# EAGLE design Hoff (EAGLE 7.2.0)
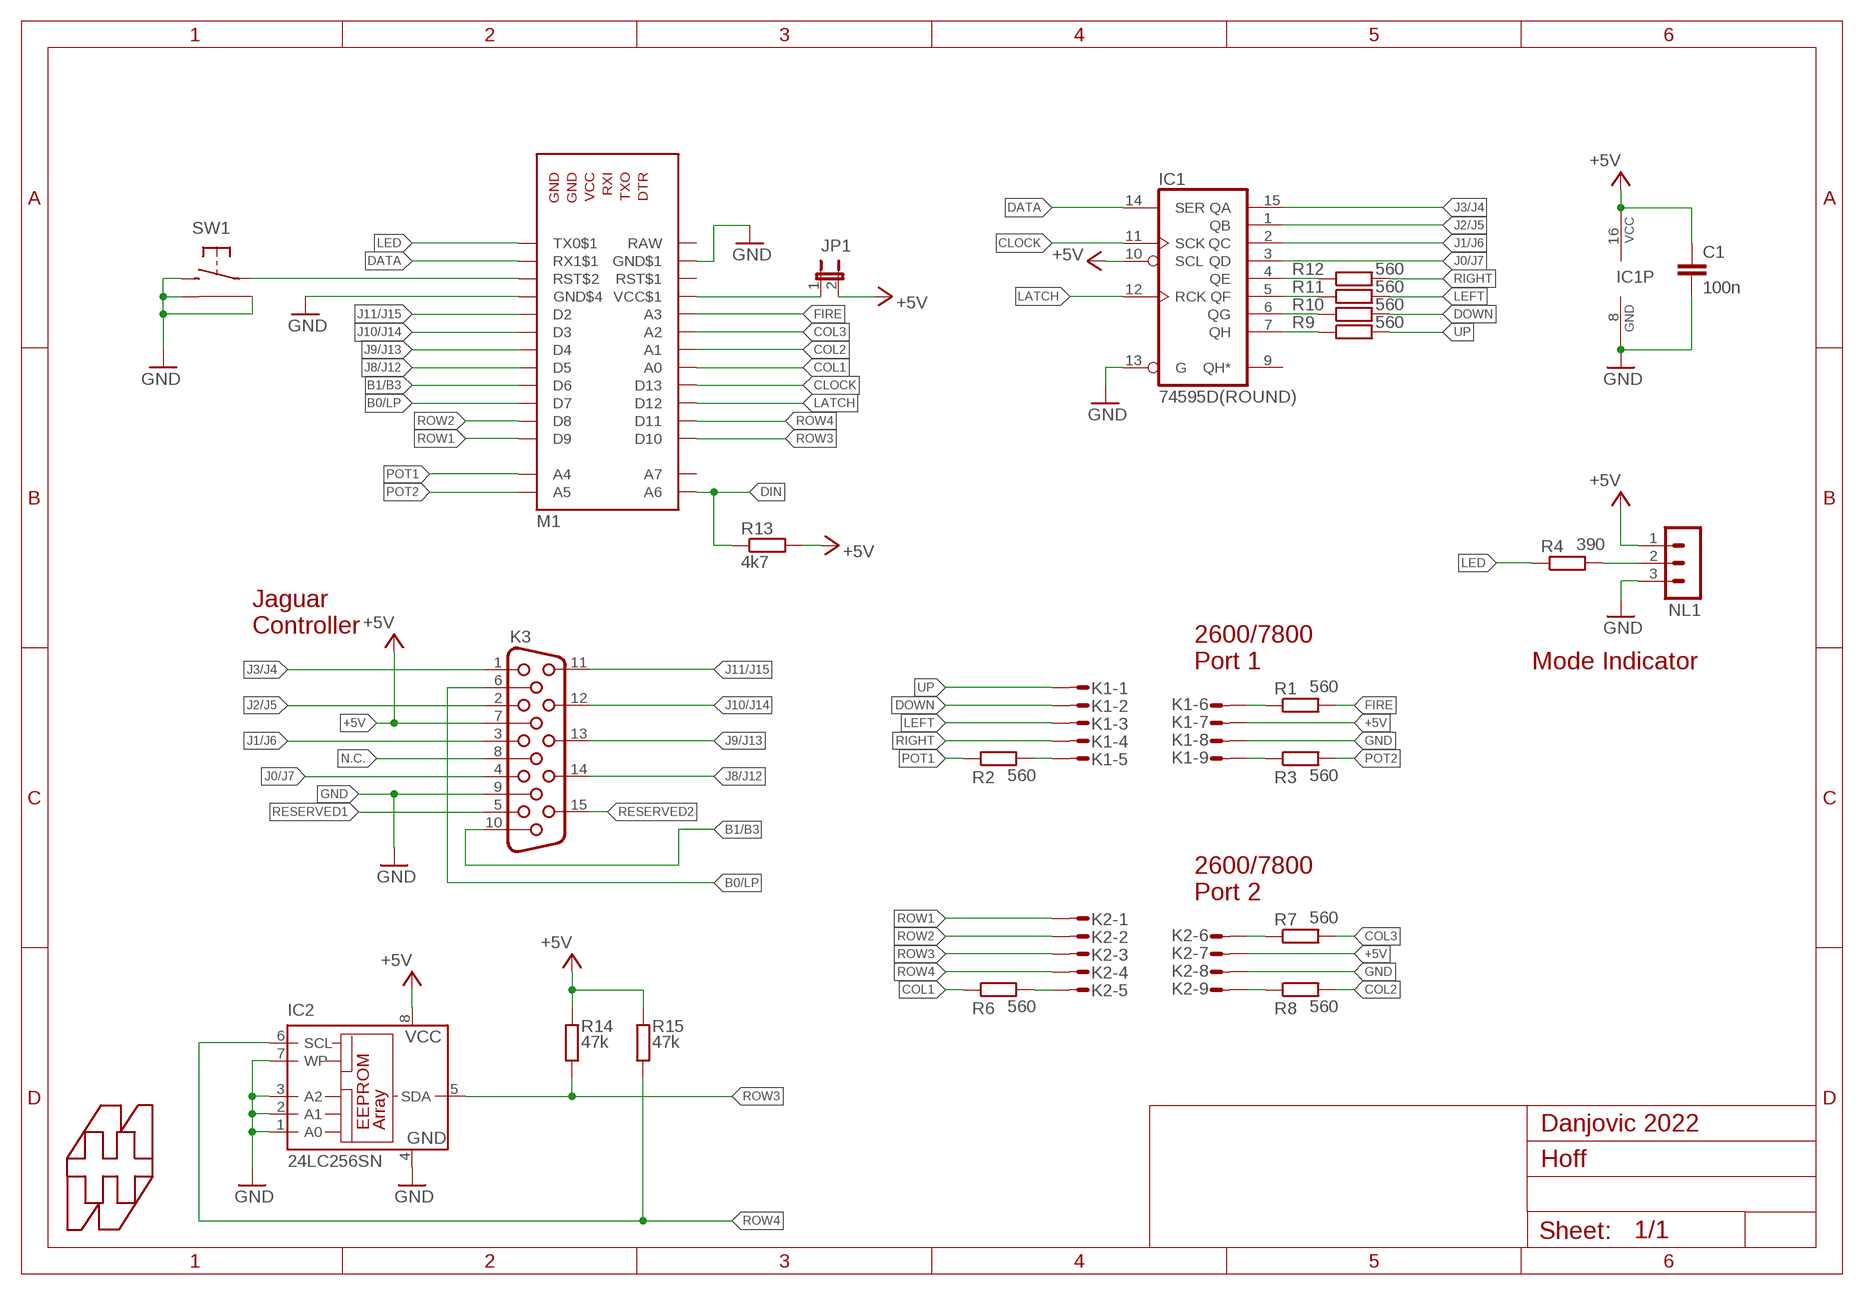
[diagram p0: schematic, sheet 1]

## Parts
C1  100n  C-EU050-024X044  [C050-024X044]
IC1  74595D(ROUND)  [DIL16-ROUND]
IC2  24LC256SN  [SO-08]
JP1  JP1E  [JP1]
K1  S09P  [S09P]
K2  S09P  [S09P]
K3  HF15H  [HDF15H]
M1  ARDUINO_PRO_MINI_SIDE_ONLY  [ARDUNIO_PRO_MINI_SIDE_ONLY]
NL1  MA03-1  [MA03-1]
R1  560  R-EU_0204/7  [0204/7]
R2  560  R-EU_0204/7  [0204/7]
R3  560  R-EU_0204/7  [0204/7]
R4  390  R-EU_0204/7  [0204/7]
R6  560  R-EU_0204/7  [0204/7]
R7  560  R-EU_0204/7  [0204/7]
R8  560  R-EU_0204/7  [0204/7]
R9  560  R-EU_0204/7  [0204/7]
R10  560  R-EU_0204/7  [0204/7]
R11  560  R-EU_0204/7  [0204/7]
R12  560  R-EU_0204/7  [0204/7]
R13  4k7  R-EU_0204/7  [0204/7]
R14  47k  R-EU_0204/7  [0204/7]
R15  47k  R-EU_0204/7  [0204/7]
SW  31-XX-GG  [B3F-31XX]
U$1  HAMMOND-1593J  [1593J]

## Nets
!RESET: M1.RST$2 SW.1(1:P)
+5V: C1.1 IC1.10(SCL) IC1.16(VCC) IC2.8(VCC) JP1.2 K1.7 K2.7 K3.7 NL1.1 R13.2 R14.2 R15.2
B0/LP: K3.6 M1.D7
B1/B3: K3.10 M1.D6
CLOCK: IC1.11(SCK) M1.D13
COL1: M1.A0 R6.1
COL2: M1.A1 R8.2
COL3: M1.A2 R7.2
DATA: IC1.14(SER) M1.RX1$1
DIN: M1.A6 R13.1
DOWN: K1.2 R10.2
FIRE: M1.A3 R1.2
GND: C1.2 IC1.8(GND) IC1.13(G) IC2.1(A0) IC2.2(A1) IC2.3(A2) IC2.4(GND) IC2.7(WP) K1.8 K2.8 K3.9 M1.GDN$1(GND$1) M1.GND$4 NL1.3 SW.2(1:S) SW.3(G$1) SW.4(G$2)
J0/J7: IC1.3(QD) K3.4
J1/J6: IC1.2(QC) K3.3
J2/J5: IC1.1(QB) K3.2
J3/J4: IC1.15(QA) K3.1
J8/J12: K3.14 M1.D5
J9/J13: K3.13 M1.D4
J10/J14: K3.12 M1.D3
J11/J15: K3.11 M1.D2
LATCH: IC1.12(RCK) M1.D12
LED: M1.TX0$1 R4.1
LEFT: K1.3 R11.2
N$1: NL1.2 R4.2
N$2: JP1.1 M1.VCC$1
N.C.: K3.8
POT1: M1.A4 R2.1
POT2: M1.A5 R3.2
R_COL1: K2.5 R6.2
R_COL2: K2.9 R8.1
R_COL3: K2.6 R7.1
R_DOWN: IC1.6(QG) R10.1
R_FIRE: K1.6 R1.1
R_LEFT: IC1.5(QF) R11.1
R_POT1: K1.5 R2.2
R_POT2: K1.9 R3.1
R_RIGHT: IC1.4(QE) R12.1
R_UP: IC1.7(QH) R9.1
RESERVED1: K3.5
RESERVED2: K3.15
RIGHT: K1.4 R12.2
ROW1: K2.1 M1.D9
ROW2: K2.2 M1.D8
ROW3: IC2.5(SDA) K2.3 M1.D10 R14.1
ROW4: IC2.6(SCL) K2.4 M1.D11 R15.1
UP: K1.1 R9.2
Unconnected: IC1.9(QH*) M1.A7 M1.RST$1

## Notes on the sheet
- Jaguar
  Controller
- 2600/7800
  Port 1
- Mode Indicator
- 2600/7800
  Port 2
- Danjovic 2022

## Power pins joined to a net without a drawn wire
RAW: M1.RAW

## Library data of the parts
C1 = rcl:C-EU: CAPACITOR, European symbol
IC1 = 74xx-us:74*595: 8-bit SHIFT REGISTER, output latch
IC2 = microchip:24*: Serial EEPROM I2C; MF: MICROCHIP; MPN: 24LC256-I/SN; OC_FARNELL: 9757996; OC_NEWARK: 27C9144
JP1 = jumper:JP1E: JUMPER
K1 K2 = con-amp-mt:S09P: AMP MT CONNECTOR; OC_FARNELL: unknown; OC_NEWARK: unknown
K3 = con-subd:HF15: SUB-D; OC_FARNELL: unknown; OC_NEWARK: unknown
M1 = Digistump:ARDUINO_PRO_MINI_SIDE_ONLY
NL1 = con-lstb:MA03-1: PIN HEADER; OC_FARNELL: unknown; OC_NEWARK: unknown
R1-R4 R6-R15 = rcl:R-EU_: RESISTOR, European symbol
SW = tactile:31-XX-GG
U$1 = box-hammond:HAMMOND-

## Board
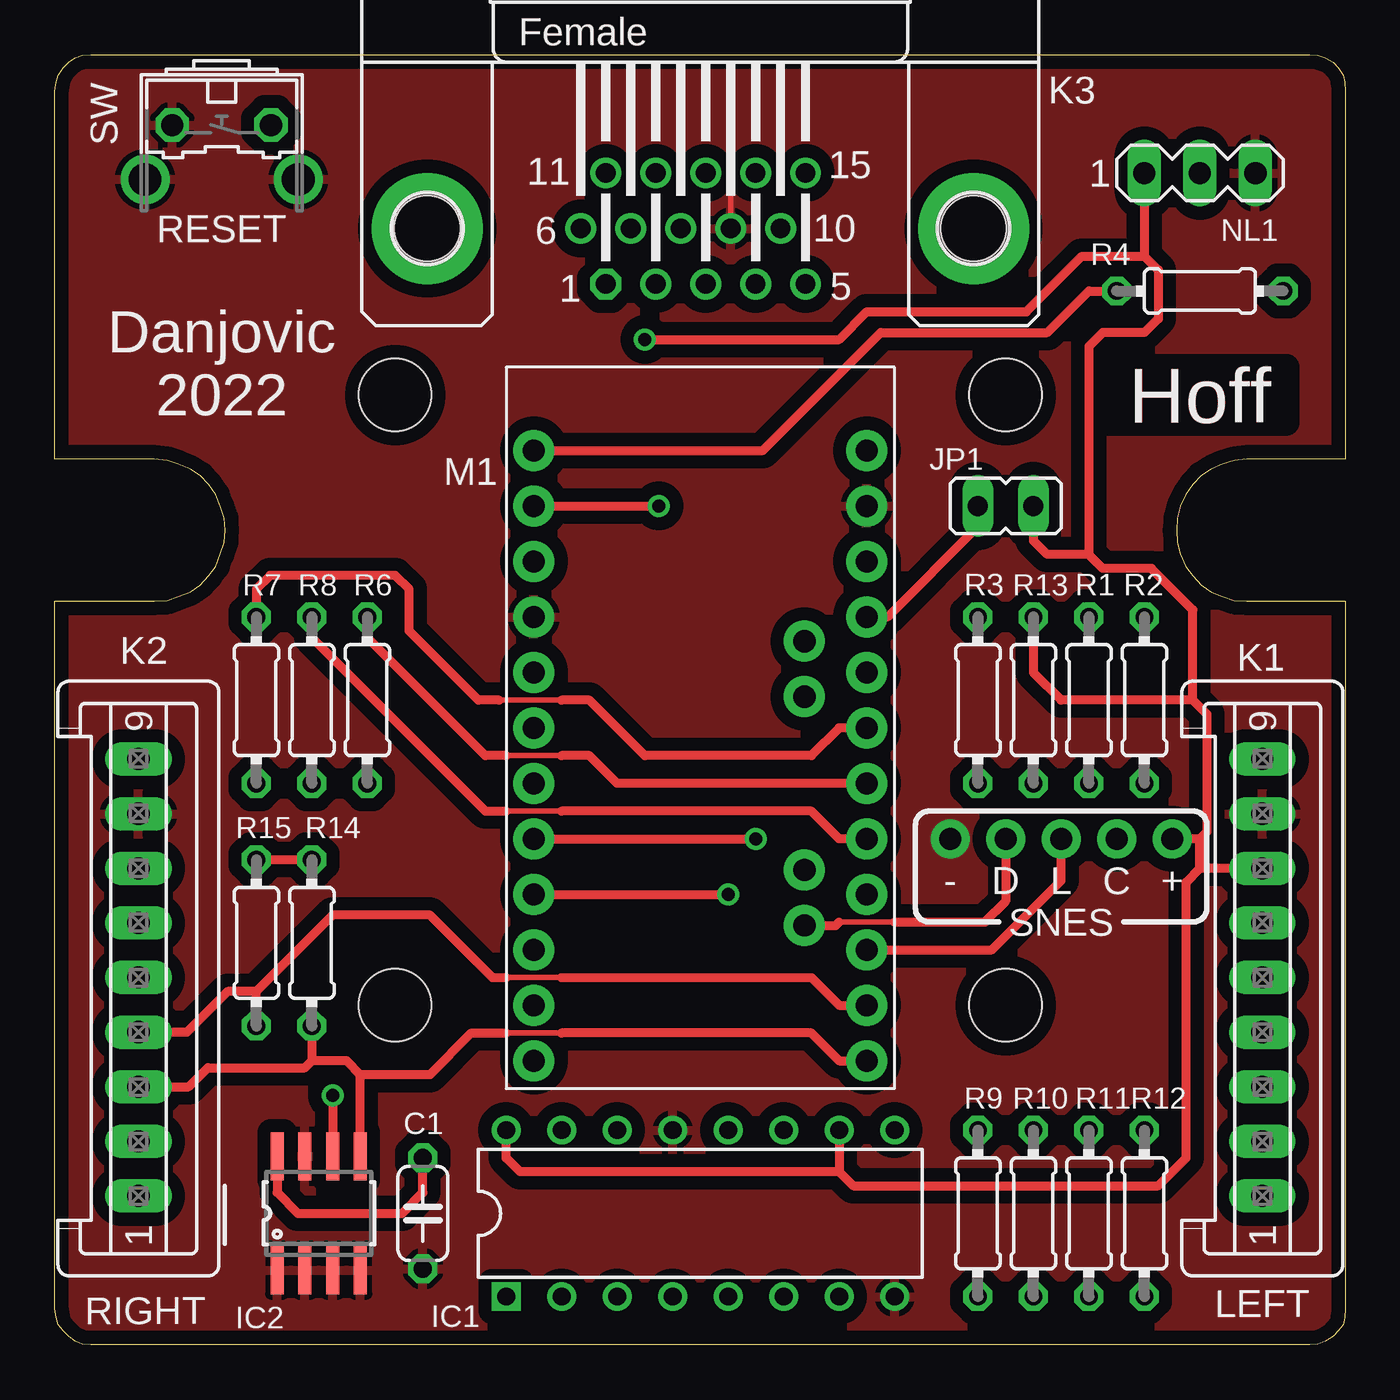
[diagram p1: board, top side]
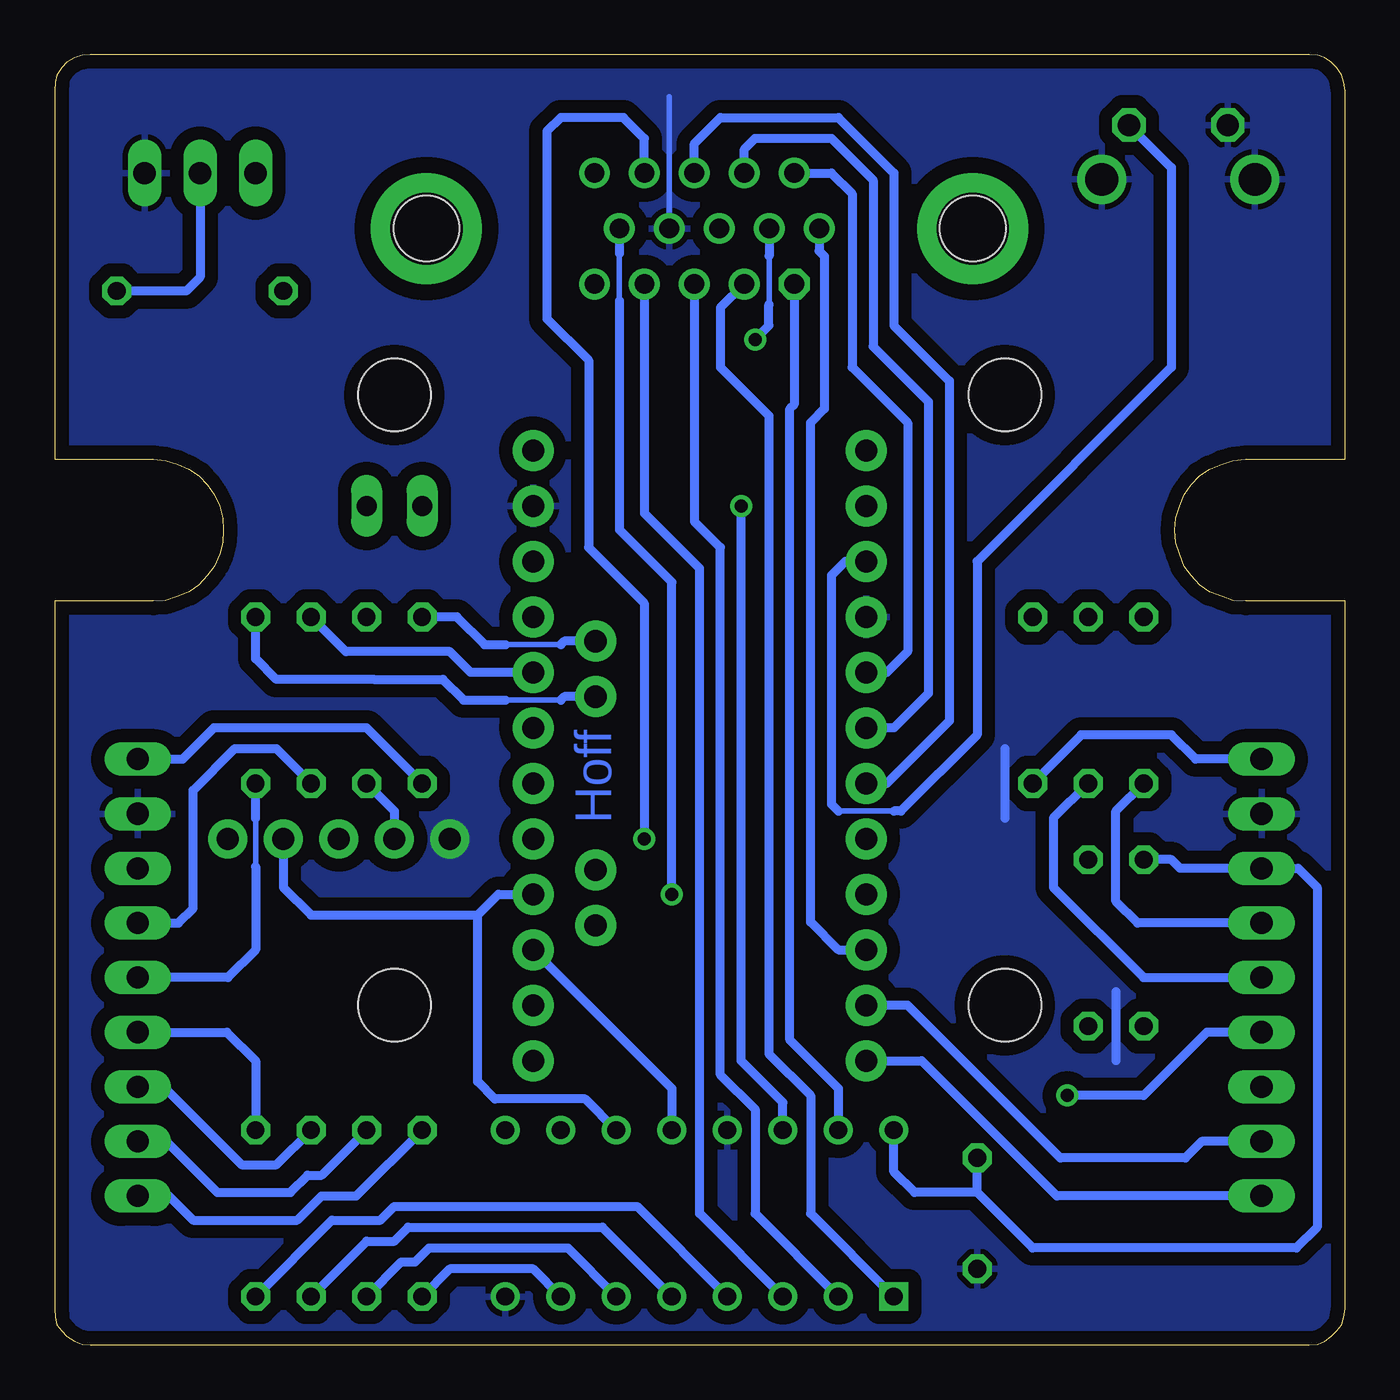
[diagram p2: board, bottom side, seen from below]

Size 59.07 x 59.07 mm. Coordinates in mm from the lower left corner, seen from the top.
Copper layers (1*16): Top 0.035mm / dielectric 1.5mm / Bottom 0.035mm
Design rules "default *": minimum track width 10mil, minimum drill 24mil, track to track 8mil, track to pad 8mil, pad to pad 8mil, via to via 8mil, smd to smd 8mil, copper to edge 25mil, drill to drill 8mil, minimum pad ring 10mil, minimum via ring 8mil, stop-mask expansion 4mil, vias tented up to drill 0mil, thermal gap 10mil

### Footprints (pad centres in the part's own frame; a part is rotated, then mirrored left to right if it is on the bottom)
C050-024X044 = drill 0.813 octagon: 1 -2.54,0; 2 2.54,0
DIL16-ROUND = drill 0.813 square: 1 -8.89,-3.81 | drill 0.813: 2 -6.35,-3.81; 3 -3.81,-3.81; 4 -1.27,-3.81; 5 1.27,-3.81; 6 3.81,-3.81; 7 6.35,-3.81; 8 8.89,-3.81; 9 8.89,3.81; 10 6.35,3.81; 11 3.81,3.81; 12 1.27,3.81; 13 -1.27,3.81; 14 -3.81,3.81; 15 -6.35,3.81; 16 -8.89,3.81
SO-08 = smd 0.6 x 2.2: 1 -1.905,-2.6; 2 -0.635,-2.6; 3 0.635,-2.6; 4 1.905,-2.6; 5 1.905,2.6; 6 0.635,2.6; 7 -0.635,2.6; 8 -1.905,2.6
JP1 = drill 0.914 long: 1 0,-1.27; 2 0,1.27
S09P = drill 1.016 long: 1 10,0; 2 7.5,0; 3 5,0; 4 2.5,0; 5 0,0; 6 -2.5,0; 7 -5,0; 8 -7.5,0; 9 -10,0
HDF15H = drill 0.9 octagon: 1 4.329,2.54 | drill 0.9: 2 2.043,2.54; 3 -0.243,2.54; 4 -2.529,2.54; 5 -4.815,2.54; 6 5.472,0; 7 3.186,0; 8 0.9,0; 9 -1.386,0; 10 -3.672,0; 11 4.329,-2.54; 12 2.043,-2.54; 13 -0.243,-2.54; 14 -2.529,-2.54; 15 -4.815,-2.54 | drill 3.302 pad 5.08: G1 -12.5,0; G2 12.5,0 | hole 3: -12.5,0; 12.5,0
ARDUNIO_PRO_MINI_SIDE_ONLY = drill 1.016 pad 1.88: A0 7.62,-5.08; A1 7.62,-2.54; A2 7.62,0; A3 7.62,2.54; A4 4.763,1.429; A5 4.763,3.969; A6 4.763,-9.049; A7 4.763,-6.509; D2 -7.62,2.54; D3 -7.62,0; D4 -7.62,-2.54; D5 -7.62,-5.08; D6 -7.62,-7.62; D7 -7.62,-10.16; D8 -7.62,-12.7; D9 -7.62,-15.24; D10 7.62,-15.24; D11 7.62,-12.7; D12 7.62,-10.16; D13 7.62,-7.62; GDN$1 7.62,10.16; GND$4 -7.62,5.08; RAW 7.62,12.7; RST$1 7.62,7.62; RST$2 -7.62,7.62; RX1$1 -7.62,10.16; TX0$1 -7.62,12.7; VCC$1 7.62,5.08
MA03-1 = drill 1.016 long: 1 -2.54,0; 2 0,0; 3 2.54,0
0204/7 = drill 0.813 octagon: 1 -3.81,0; 2 3.81,0
B3F-31XX = drill 1.016 octagon: 1 -2.261,-1.245; 2 2.261,-1.245 | drill 1.499 pad 2.159: 3 -3.505,1.245; 4 3.505,1.245
1593J = hole 3.302: -13.97,-13.97; 13.97,-13.97; -13.97,13.97; 13.97,13.97

### Placement (x,y rotation side)
C1  16.85,6.02 270 top
IC1  29.55,6.02 0 top
IC2  12.09,6.02 0 top
JP1  43.52,38.41 270 top
K1  55.27,16.82 270 top
K2  3.84,16.82 270 top
K3  29.55,51.11 180 top
M1  29.55,28.25 0 top
NL1  52.41,53.65 0 top
R1  47.33,29.52 90 top
R2  49.87,29.52 270 top
R3  42.25,29.52 90 top
R4  52.41,48.25 0 top
R6  11.77,29.52 270 top
R7  9.23,29.52 90 top
R8  14.31,29.52 90 top
R9  42.25,6.02 90 top
R10  44.79,6.02 90 top
R11  47.33,6.02 90 top
R12  49.87,6.02 90 top
R13  44.79,29.52 90 top
R14  11.77,18.41 90 top
R15  9.23,18.41 90 top
SW  7.65,54.6 180 top
U$1  29.55,29.52 180 top

### Tracks (layer width: path | path; a pad name or v marks a point on that pad's centre or on a via)
!RESET
  Bottom 0.254: 23.2,24.44 20.66,24.44
  Bottom 0.406: M1.RST$2 22.88,35.87 23.52,35.23 23.52,24.76 23.2,24.44 | SW.1 7.96,53.9 7.96,44.76 16.85,35.87 16.85,27.93 20.35,24.44 20.66,24.44
+5V  (via drill 0.6, 1 pad 1.78)
  Top 0.406: v27.01,46.03 35.9,46.03 37.17,47.3 44.48,47.3 47.02,49.84 49.87,49.84 | 35.9,7.93 36.54,7.29 50.51,7.29 51.78,8.56 51.78,21.18 52.41,21.82 | 35.9,7.93 21.3,7.93 20.66,8.56 IC1.16 | IC1.10 35.9,7.93 | IC2.8 10.19,6.98 11.14,6.02 15.9,6.02 16.85,6.98 C1.1 | R15.2 R14.2 | JP1.2 44.79,36.82 45.43,36.19 47.33,36.19 | 47.33,36.19 47.33,45.71 47.97,46.34 49.87,46.34 50.51,46.98 50.51,49.2 49.87,49.84 | 52.1,29.52 46.06,29.52 44.79,30.79 R13.2 | 52.41,23.17 v51.14,23.17 | K1.7 52.41,21.82 | 52.41,21.82 52.41,23.17 | 52.41,23.17 52.73,23.49 52.73,28.88 52.1,29.52 | 52.1,29.52 52.1,33.65 50.19,35.55 47.97,35.55 47.33,36.19 | NL1.1 49.87,49.84
  Bottom 0.254: 26.37,49.85 26.37,47.63
  Bottom 0.406: 16.85,6.98 19.71,6.98 20.66,7.93 IC1.16 | 16.85,6.98 14.31,4.43 2.25,4.43 1.3,5.39 1.3,20.94 2.17,21.82 K2.7 7.56,21.82 7.96,22.21 R15.2 | 16.85,6.98 C1.1 | K3.7 26.37,49.85 | v27.01,46.03 26.38,46.66 26.38,47.62 26.37,47.63
B0/LP
  Bottom 0.406: M1.D7 23.2,18.09 24.47,19.36 24.47,42.22 23.84,42.85 23.84,49.84 24.08,50.08 K3.6
B1/B3  (via drill 0.6)
  Top 0.406: M1.D6 v30.82,20.63
  Bottom 0.254: 33.22,49.98 33.22,47.79
  Bottom 0.406: K3.10 33.22,49.98 | v30.82,20.63 30.82,34.91 33.22,37.32 33.22,47.79
CLOCK  (via drill 1 pad 1.78)
  Bottom 0.406: IC1.11 34.79,11.26 38.92,11.26 39.71,12.06 39.71,19.67 | 39.71,19.67 38.76,20.63 M1.D13 | v48.6,23.17 48.6,20.94 47.33,19.67 39.71,19.67
COL1
  Top 0.254: 23.2,24.44 20.66,24.44
  Top 0.406: M1.A0 35.9,23.17 34.63,24.44 23.2,24.44 | R6.1 11.77,32.37 19.71,24.44 20.66,24.44
COL2
  Top 0.254: 20.66,26.98 23.2,26.98
  Top 0.406: M1.A1 25.74,25.71 24.47,26.98 23.2,26.98 | R8.2 14.31,32.37 19.71,26.98 20.66,26.98
COL3
  Top 0.254: 23.2,29.52 20.35,29.52
  Top 0.406: M1.A2 35.9,28.25 34.63,26.98 27.01,26.98 24.47,29.52 23.2,29.52 | R7.2 9.23,34.6 9.87,35.23 15.58,35.23 16.22,34.6 16.22,32.69 19.39,29.52 20.35,29.52
DATA  (via drill 0.6)
  Top 0.406: M1.RX1$1 v27.65,38.41
  Bottom 0.406: IC1.14 25.74,11.1 27.65,13.01 v27.65,38.41
DIN  (via drill 1 pad 1.78)
  Top 0.254: 35.9,19.36 38.44,19.36
  Top 0.406: M1.A6 35.74,19.2 35.9,19.36 | 38.44,19.36 42.57,19.36 43.52,20.31 v43.52,23.17
  Bottom 0.406: R13.1 43.52,24.44 v43.52,23.17
DOWN
  Bottom 0.406: K1.2 53.96,9.32 51.62,6.98 48.28,6.98 47.49,7.77 46.86,7.77 R10.2
FIRE
  Bottom 0.406: M1.A3 40.03,30.79 40.98,31.74 45.74,31.74 R1.2
GND  (via drill 1 pad 1.78)
  Top 0.254: K3.9 30.94,56.94
  Bottom 0.254: K3.9 30.94,57.14
  Bottom 0.406: 15.58,27.3 15.58,24.12 | 10.5,16.18 10.5,13.01
  other vias: 40.98,23.17
  pour Bottom (isolate 0.61): 59.08,59.05 59.08,-0.01 0.03,-0.01 0.03,59.05
  pour Top (isolate 0.61): 60.03,59.36 60.03,-1.6 -0.93,-0.33 -0.93,59.36
J0/J7
  Bottom 0.406: IC1.3 29.55,6.02 29.55,35.55 32.08,38.08 K3.4
J1/J6
  Bottom 0.406: IC1.2 27.01,6.02 27.01,10.79 28.6,12.37 28.6,36.5 29.8,37.7 K3.3
J2/J5
  Bottom 0.406: IC1.1 24.47,6.02 24.47,11.42 26.38,13.32 26.38,42.54 28.6,44.76 28.6,47.48 K3.2
J3/J4
  Bottom 0.406: IC1.15 23.2,11.74 25.42,13.96 25.42,42.85 25.22,43.05 K3.1
J8/J12  (via drill 0.6)
  Top 0.406: M1.D5 v32.09,23.17
  Bottom 0.406: K3.14 32.08,55.22 33.04,56.19 35.9,56.19 36.54,55.55 36.54,46.98 34.63,45.08 34.63,36.5 32.09,33.96 v32.09,23.17
J9/J13
  Bottom 0.406: K3.13 29.8,54.99 28.6,56.19 23.2,56.19 20.66,53.65 20.66,46.66 18.12,44.12 18.12,28.56 20.98,25.71 M1.D4
J10/J14
  Bottom 0.406: K3.12 27.51,54.74 27.01,55.23 23.52,55.23 21.62,53.33 21.62,45.71 19.08,43.17 19.08,29.83 20.66,28.25 M1.D3
J11/J15
  Bottom 0.406: K3.11 23.52,53.65 22.57,52.69 22.57,44.76 20.03,42.22 20.03,31.74 20.98,30.79 M1.D2
LATCH  (via drill 1 pad 1.78)
  Top 0.406: M1.D12 42.89,18.09 46.06,21.26 v46.06,23.17
  Bottom 0.406: M1.D12 30.82,11.74 IC1.12
LED
  Top 0.406: M1.TX0$1 32.41,40.95 37.81,46.34 45.43,46.34 47.33,48.25 R4.1
LEFT
  Bottom 0.406: K1.3 54.08,11.82 50.51,8.24 48.92,8.24 R11.2
N$1
  Bottom 0.406: NL1.2 52.41,48.88 53.05,48.25 R4.2
N$2
  Top 0.406: JP1.1 42.25,37.45 38.13,33.33 M1.VCC$1
POT1
  Bottom 0.254: 35.9,29.52 38.44,29.52
  Bottom 0.406: M1.A4 35.74,29.68 35.9,29.52 | R2.1 49.87,31.42 48.92,30.47 44.48,30.47 41.3,30.47 40.35,29.52 38.44,29.52
POT2
  Bottom 0.254: 35.9,32.06 38.44,32.06
  Bottom 0.406: M1.A5 35.74,32.22 35.9,32.06 | 38.44,32.06 39.39,32.06 40.67,33.33 R3.2
R_COL1
  Bottom 0.406: R6.2 13.36,24.12 13.36,20.94 9.23,16.82 K2.5
R_COL2
  Bottom 0.406: K2.9 6.85,26.82 7.96,27.93 12.09,27.93 R8.1
R_COL3
  Bottom 0.406: K2.6 9.51,19.32 10.5,20.31 10.5,24.44 R7.1
R_DOWN
  Bottom 0.406: R10.1 43.21,3.8 42.57,3.8 41.93,4.43 35.59,4.43 IC1.6
R_FIRE
  Bottom 0.406: R1.1 48.92,27.3 50.82,27.3 52.73,25.39 52.73,19.99 53.41,19.32 K1.6
R_LEFT
  Bottom 0.406: R11.1 44.79,4.75 43.52,4.75 42.89,5.39 34,5.39 IC1.5
R_POT1
  Bottom 0.254: 49.87,24.12 49.87,21.9
  Bottom 0.406: K1.5 51.14,16.82 49.87,18.09 49.87,21.9 | 49.87,24.12 R2.2
R_POT2
  Bottom 0.406: R3.1 44.79,28.25 51.78,28.25 53.21,26.82 K1.9
R_RIGHT
  Bottom 0.406: R12.1 46.38,5.71 44.16,5.71 43.52,6.34 32.41,6.34 IC1.4
R_UP
  Bottom 0.406: IC1.7 37.17,3.48 40.98,3.48 R9.1
RIGHT
  Bottom 0.406: K1.4 51.18,14.32 49.87,13.01 R12.2
ROW1
  Bottom 0.406: M1.D9 19.39,13.01 13.2,6.82 K2.1
ROW2
  Bottom 0.406: M1.D8 20.03,15.55 13.04,8.56 7.33,8.56 6.57,9.32 K2.2
ROW3
  Top 0.254: 20.66,14.28 23.2,14.28
  Top 0.406: M1.D10 35.9,13.01 34.63,14.28 23.2,14.28 | R14.1 11.77,13.01 | IC2.5 13.99,12.37 | 13.99,12.37 13.36,13.01 11.77,13.01 | 13.99,12.37 17.17,12.37 19.08,14.28 20.66,14.28 | K2.3 6.14,11.82 7.01,12.69 11.46,12.69 11.77,13.01
ROW4  (via drill 0.6)
  Top 0.254: 23.2,16.82 20.66,16.82
  Top 0.406: 9.23,16.18 12.72,19.67 17.17,19.67 20.03,16.82 20.66,16.82 | K2.4 6.06,14.32 7.92,16.18 9.23,16.18 | R15.1 9.23,16.18 | v12.72,11.42 IC2.6 | 23.2,16.82 34.63,16.82 35.9,15.55 M1.D11
  Bottom 0.406: K2.4 6.34,14.32 9.23,11.42 v12.72,11.42
UP
  Bottom 0.406: K1.1 53.84,6.82 52.73,5.71 47.97,5.71 46.86,6.82 45.27,6.82 R9.2

### Text on the board
Top: Hoff
Bottom: Hoff
tPlace: RESET | Danjovic / 2022 | Hoff | - | D | L | C | + | SNES | RIGHT | LEFT